# Altium project NA61_BPD_FEE.PrjPcb (part 2 of 4)

## Sheet Amp.SchDoc
size A4
Used 100 times, as channels U_Bank1/U_Amp, U_Bank1/U_Amp, U_Bank1/U_Amp, U_Bank1/U_Amp, U_Bank1/U_Amp, U_Bank2/U_Amp, U_Bank2/U_Amp, U_Bank2/U_Amp, U_Bank2/U_Amp, U_Bank2/U_Amp, U_Bank3/U_Amp, U_Bank3/U_Amp, U_Bank3/U_Amp, U_Bank3/U_Amp, U_Bank3/U_Amp, U_Bank4/U_Amp, U_Bank4/U_Amp, U_Bank4/U_Amp, U_Bank4/U_Amp, U_Bank4/U_Amp, U_Bank5/U_Amp, U_Bank5/U_Amp, U_Bank5/U_Amp, U_Bank5/U_Amp, U_Bank5/U_Amp, U_Bank6/U_Amp, U_Bank6/U_Amp, U_Bank6/U_Amp, U_Bank6/U_Amp, U_Bank6/U_Amp, U_Bank7/U_Amp, U_Bank7/U_Amp, U_Bank7/U_Amp, U_Bank7/U_Amp, U_Bank7/U_Amp, U_Bank8/U_Amp, U_Bank8/U_Amp, U_Bank8/U_Amp, U_Bank8/U_Amp, U_Bank8/U_Amp, U_Bank9/U_Amp, U_Bank9/U_Amp, U_Bank9/U_Amp, U_Bank9/U_Amp, U_Bank9/U_Amp, U_Bank10/U_Amp, U_Bank10/U_Amp, U_Bank10/U_Amp, U_Bank10/U_Amp, U_Bank10/U_Amp, U_Bank11/U_Amp, U_Bank11/U_Amp, U_Bank11/U_Amp, U_Bank11/U_Amp, U_Bank11/U_Amp, U_Bank12/U_Amp, U_Bank12/U_Amp, U_Bank12/U_Amp, U_Bank12/U_Amp, U_Bank12/U_Amp, U_Bank13/U_Amp, U_Bank13/U_Amp, U_Bank13/U_Amp, U_Bank13/U_Amp, U_Bank13/U_Amp, U_Bank14/U_Amp, U_Bank14/U_Amp, U_Bank14/U_Amp, U_Bank14/U_Amp, U_Bank14/U_Amp, U_Bank15/U_Amp, U_Bank15/U_Amp, U_Bank15/U_Amp, U_Bank15/U_Amp, U_Bank15/U_Amp, U_Bank16/U_Amp, U_Bank16/U_Amp, U_Bank16/U_Amp, U_Bank16/U_Amp, U_Bank16/U_Amp, U_Bank17/U_Amp, U_Bank17/U_Amp, U_Bank17/U_Amp, U_Bank17/U_Amp, U_Bank17/U_Amp, U_Bank18/U_Amp, U_Bank18/U_Amp, U_Bank18/U_Amp, U_Bank18/U_Amp, U_Bank18/U_Amp, U_Bank19/U_Amp, U_Bank19/U_Amp, U_Bank19/U_Amp, U_Bank19/U_Amp, U_Bank19/U_Amp, U_Bank20/U_Amp, U_Bank20/U_Amp, U_Bank20/U_Amp, U_Bank20/U_Amp, U_Bank20/U_Amp. Parts and nets are listed once, with the designators drawn on the sheet.
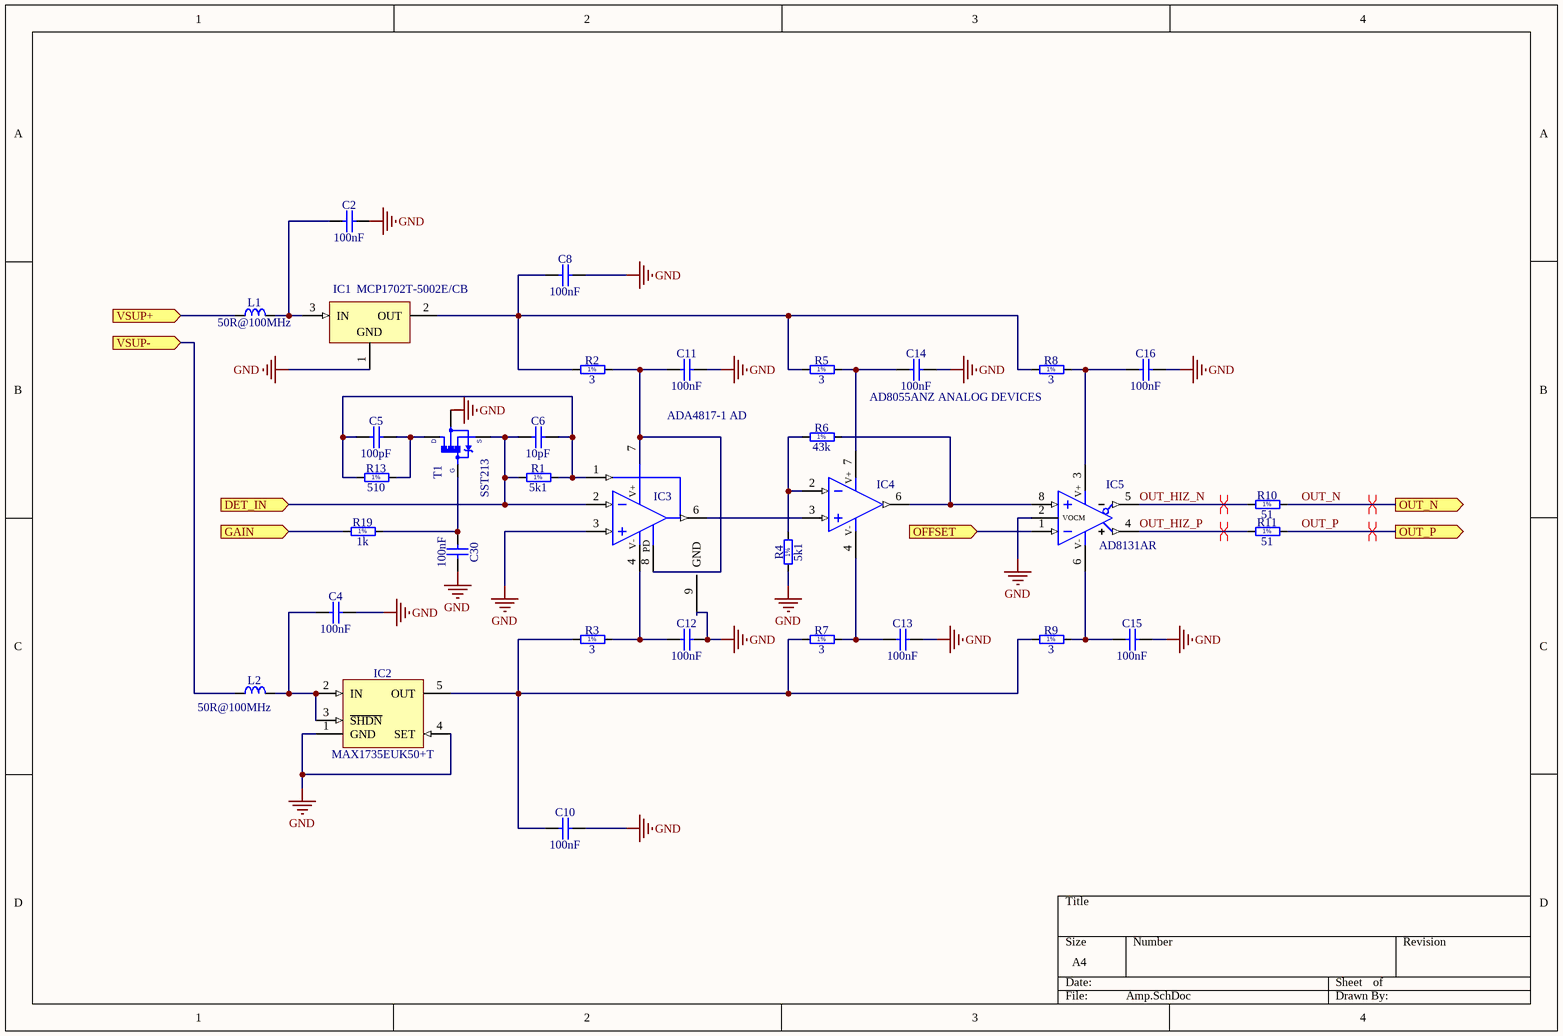
[diagram p2: Amp.SchDoc]

### Parts
C2  100nF  [CAPC2012X135N]
C4  100nF  [CAPC2012X135N]
C5  100pF  [CAPC2012X88N]
C6  10pF  [CAPC2012X135N]
C8  100nF  [CAPC2012X135N]
C10  100nF  [CAPC2012X135N]
C11  100nF  [CAPC2012X135N]
C12  100nF  [CAPC2012X135N]
C13  100nF  [CAPC2012X135N]
C14  100nF  [CAPC2012X135N]
C15  100nF  [CAPC2012X135N]
C16  100nF  [CAPC2012X135N]
C30  100nF  [CAPC2012X135N]
IC1  MCP1702T-5002E/CB  [SOT95P255X145-3N]
IC2  MAX1735EUK50+T  [SOT95P280X145-5N]
IC3  ADA4817-1 AD  [SOIC127P600X175-9N-S229]
IC4  AD8055ANZ ANALOG DEVICES  [SOIC127P600X175-8N]
IC5  AD8131AR  [SOIC127P600X175-8N]
L1  50R@100MHz  [IND_MURATA_BLM31PG]
L2  50R@100MHz  [IND_MURATA_BLM31PG]
R1  5k1  [RESC2012X60N]
R2  3  [RESC2012X60N]
R3  3  [RESC2012X60N]
R4  5k1  [RESC2012X60N]
R5  3  [RESC2012X60N]
R6  43k  [RESC2012X60N]
R7  3  [RESC2012X60N]
R8  3  [RESC2012X60N]
R9  3  [RESC2012X60N]
R10  51  [RESC2012X60N]
R11  51  [RESC2012X60N]
R13  510  [RESC2012X60N]
R19  1k  [RESC2012X60N]
T1  SST213  [SOT143N]

### Ports
DET_IN (in), GAIN (in), OFFSET (in), OUT_N (out), OUT_P (out), VSUP+ (in), VSUP- (in)

### Nets
GND: C2.2 C4.2 C8.2 C10.2 C11.2 C12.2 C13.2 C14.2 C15.2 C16.2 C30.2 IC1.1(GND) IC2.1(GND) IC2.4(SET) IC3.3(IN+) IC3.9(GND) IC5.2(VOCM) R4.1 T1.1(BODY)
DET_IN: C6.1 IC3.2(IN-) R1.1 T1.2(S) ; port DET_IN
GAIN: R19.1 ; port GAIN
OFFSET: IC5.1(IN-) ; port OFFSET
OUT_HIZ_N: IC5.5(VOUT-) R10.1
OUT_HIZ_P: IC5.4(VOUT+) R11.1
OUT_N: R10.2 ; port OUT_N
OUT_P: R11.2 ; port OUT_P
VSUP+: L1.1 ; port VSUP+
VSUP-: L2.1 ; port VSUP-
NetC2_1: C2.1 IC1.3(IN) L1.2
NetC4_1: C4.1 IC2.2(IN) IC2.3(~{SHDN}) L2.2
NetC5_1: C5.1 C6.2 IC3.1(FB) R1.2 R13.1
NetC5_2: C5.2 R13.2 T1.3(D)
NetC8_1: C8.1 IC1.2(OUT) R2.1 R5.1 R8.1
NetC10_1: C10.1 IC2.5(OUT) R3.1 R7.1 R9.1
NetC11_1: C11.1 IC3.7(V+) IC3.8(PD) R2.2
NetC12_1: C12.1 IC3.4(V-) R3.2
NetC13_1: C13.1 IC4.4(V-) R7.2
NetC14_1: C14.1 IC4.7(V+) R5.2
NetC15_1: C15.1 IC5.6(V-) R9.2
NetC16_1: C16.1 IC5.3(V+) R8.2
NetC30_1: C30.1 R19.2 T1.4(G)
NetIC3_6: IC3.6(OUT) IC4.3(IN+)
NetIC4_2: IC4.2(IN-) R4.2 R6.1
NetIC4_6: IC4.6(OUT) IC5.8(IN+) R6.2

### Channels
U_Bank1/U_Amp: designators C2=C2_U_Amp5 C4=C4_U_Amp5 C5=C5_U_Amp5 C6=C6_U_Amp5 C8=C8_U_Amp5 C10=C10_U_Amp5 C11=C11_U_Amp5 C12=C12_U_Amp5 C13=C13_U_Amp5 C14=C14_U_Amp5 C15=C15_U_Amp5 C16=C16_U_Amp5 C30=C30_U_Bank1_U_Amp#1 IC1=IC1_U_Amp5 IC2=IC2_U_Amp5 IC3=IC3_U_Amp5 IC4=IC4_U_Amp5 IC5=IC5_U_Amp5 L1=L1_U_Amp5 L2=L2_U_Amp5 R1=R1_U_Amp5 R2=R2_U_Amp5 R3=R3_U_Amp5 R4=R4_U_Amp5 R5=R5_U_Amp5 R6=R6_U_Amp5 R7=R7_U_Amp5 R8=R8_U_Amp5 R9=R9_U_Amp5 R10=R10_U_Amp5 R11=R11_U_Amp5 R13=R13_U_Amp5 R19=R19_U_Bank1_U_Amp#1 T1=T1_U_Amp5; ports DET_IN=DET_IN_A GAIN=NetP1_2 OFFSET=NetIC5_U_Amp1_1 OUT_N=OUT_A_N_U_Bank1 OUT_P=OUT_A_P_U_Bank1 VSUP+=+VSUP VSUP-=-VSUP
U_Bank1/U_Amp: designators C2=C2_U_Amp4 C4=C4_U_Amp4 C5=C5_U_Amp4 C6=C6_U_Amp4 C8=C8_U_Amp4 C10=C10_U_Amp4 C11=C11_U_Amp4 C12=C12_U_Amp4 C13=C13_U_Amp4 C14=C14_U_Amp4 C15=C15_U_Amp4 C16=C16_U_Amp4 C30=C30_U_Bank1_U_Amp#2 IC1=IC1_U_Amp4 IC2=IC2_U_Amp4 IC3=IC3_U_Amp4 IC4=IC4_U_Amp4 IC5=IC5_U_Amp4 L1=L1_U_Amp4 L2=L2_U_Amp4 R1=R1_U_Amp4 R2=R2_U_Amp4 R3=R3_U_Amp4 R4=R4_U_Amp4 R5=R5_U_Amp4 R6=R6_U_Amp4 R7=R7_U_Amp4 R8=R8_U_Amp4 R9=R9_U_Amp4 R10=R10_U_Amp4 R11=R11_U_Amp4 R13=R13_U_Amp4 R19=R19_U_Bank1_U_Amp#2 T1=T1_U_Amp4; ports DET_IN=DET_IN_B GAIN=NetP1_2 OFFSET=NetIC5_U_Amp1_1 OUT_N=OUT_B_N_U_Bank1 OUT_P=OUT_B_P_U_Bank1 VSUP+=+VSUP VSUP-=-VSUP
U_Bank1/U_Amp: designators C2=C2_U_Amp3 C4=C4_U_Amp3 C5=C5_U_Amp3 C6=C6_U_Amp3 C8=C8_U_Amp3 C10=C10_U_Amp3 C11=C11_U_Amp3 C12=C12_U_Amp3 C13=C13_U_Amp3 C14=C14_U_Amp3 C15=C15_U_Amp3 C16=C16_U_Amp3 C30=C30_U_Bank1_U_Amp#3 IC1=IC1_U_Amp3 IC2=IC2_U_Amp3 IC3=IC3_U_Amp3 IC4=IC4_U_Amp3 IC5=IC5_U_Amp3 L1=L1_U_Amp3 L2=L2_U_Amp3 R1=R1_U_Amp3 R2=R2_U_Amp3 R3=R3_U_Amp3 R4=R4_U_Amp3 R5=R5_U_Amp3 R6=R6_U_Amp3 R7=R7_U_Amp3 R8=R8_U_Amp3 R9=R9_U_Amp3 R10=R10_U_Amp3 R11=R11_U_Amp3 R13=R13_U_Amp3 R19=R19_U_Bank1_U_Amp#3 T1=T1_U_Amp3; ports DET_IN=DET_IN_C GAIN=NetP1_2 OFFSET=NetIC5_U_Amp1_1 OUT_N=OUT_C_N_U_Bank1 OUT_P=OUT_C_P_U_Bank1 VSUP+=+VSUP VSUP-=-VSUP
U_Bank1/U_Amp: designators C2=C2_U_Amp2 C4=C4_U_Amp2 C5=C5_U_Amp2 C6=C6_U_Amp2 C8=C8_U_Amp2 C10=C10_U_Amp2 C11=C11_U_Amp2 C12=C12_U_Amp2 C13=C13_U_Amp2 C14=C14_U_Amp2 C15=C15_U_Amp2 C16=C16_U_Amp2 C30=C30_U_Bank1_U_Amp#4 IC1=IC1_U_Amp2 IC2=IC2_U_Amp2 IC3=IC3_U_Amp2 IC4=IC4_U_Amp2 IC5=IC5_U_Amp2 L1=L1_U_Amp2 L2=L2_U_Amp2 R1=R1_U_Amp2 R2=R2_U_Amp2 R3=R3_U_Amp2 R4=R4_U_Amp2 R5=R5_U_Amp2 R6=R6_U_Amp2 R7=R7_U_Amp2 R8=R8_U_Amp2 R9=R9_U_Amp2 R10=R10_U_Amp2 R11=R11_U_Amp2 R13=R13_U_Amp2 R19=R19_U_Bank1_U_Amp#4 T1=T1_U_Amp2; ports DET_IN=DET_IN_D GAIN=NetP1_2 OFFSET=NetIC5_U_Amp1_1 OUT_N=OUT_D_N_U_Bank1 OUT_P=OUT_D_P_U_Bank1 VSUP+=+VSUP VSUP-=-VSUP
U_Bank1/U_Amp: designators C2=C2_U_Amp1 C4=C4_U_Amp1 C5=C5_U_Amp1 C6=C6_U_Amp1 C8=C8_U_Amp1 C10=C10_U_Amp1 C11=C11_U_Amp1 C12=C12_U_Amp1 C13=C13_U_Amp1 C14=C14_U_Amp1 C15=C15_U_Amp1 C16=C16_U_Amp1 C30=C30_U_Bank1_U_Amp#5 IC1=IC1_U_Amp1 IC2=IC2_U_Amp1 IC3=IC3_U_Amp1 IC4=IC4_U_Amp1 IC5=IC5_U_Amp1 L1=L1_U_Amp1 L2=L2_U_Amp1 R1=R1_U_Amp1 R2=R2_U_Amp1 R3=R3_U_Amp1 R4=R4_U_Amp1 R5=R5_U_Amp1 R6=R6_U_Amp1 R7=R7_U_Amp1 R8=R8_U_Amp1 R9=R9_U_Amp1 R10=R10_U_Amp1 R11=R11_U_Amp1 R13=R13_U_Amp1 R19=R19_U_Bank1_U_Amp#5 T1=T1_U_Amp1; ports DET_IN=DET_IN_E GAIN=NetP1_2 OFFSET=NetIC5_U_Amp1_1 OUT_N=OUT_E_N_U_Bank1 OUT_P=OUT_E_P_U_Bank1 VSUP+=+VSUP VSUP-=-VSUP
U_Bank2/U_Amp: designators end in _U_Bank2_U_Amp#1; ports DET_IN=DET_IN_A GAIN=NetP1_2 OFFSET=NetIC5_U_Bank2_U_Amp#1_1 OUT_N=OUT_A_N_U_Bank2 OUT_P=OUT_A_P_U_Bank2 VSUP+=+VSUP VSUP-=-VSUP
U_Bank2/U_Amp: designators end in _U_Bank2_U_Amp#2; ports DET_IN=DET_IN_B GAIN=NetP1_2 OFFSET=NetIC5_U_Bank2_U_Amp#1_1 OUT_N=OUT_B_N_U_Bank2 OUT_P=OUT_B_P_U_Bank2 VSUP+=+VSUP VSUP-=-VSUP
U_Bank2/U_Amp: designators end in _U_Bank2_U_Amp#3; ports DET_IN=DET_IN_C GAIN=NetP1_2 OFFSET=NetIC5_U_Bank2_U_Amp#1_1 OUT_N=OUT_C_N_U_Bank2 OUT_P=OUT_C_P_U_Bank2 VSUP+=+VSUP VSUP-=-VSUP
U_Bank2/U_Amp: designators end in _U_Bank2_U_Amp#4; ports DET_IN=DET_IN_D GAIN=NetP1_2 OFFSET=NetIC5_U_Bank2_U_Amp#1_1 OUT_N=OUT_D_N_U_Bank2 OUT_P=OUT_D_P_U_Bank2 VSUP+=+VSUP VSUP-=-VSUP
U_Bank2/U_Amp: designators end in _U_Bank2_U_Amp#5; ports DET_IN=DET_IN_E GAIN=NetP1_2 OFFSET=NetIC5_U_Bank2_U_Amp#1_1 OUT_N=OUT_E_N_U_Bank2 OUT_P=OUT_E_P_U_Bank2 VSUP+=+VSUP VSUP-=-VSUP
U_Bank3/U_Amp: designators end in _U_Bank3_U_Amp#1; ports DET_IN=DET_IN_A GAIN=NetP1_2 OFFSET=NetIC5_U_Bank3_U_Amp#1_1 OUT_N=OUT_A_N_U_Bank3 OUT_P=OUT_A_P_U_Bank3 VSUP+=+VSUP VSUP-=-VSUP
U_Bank3/U_Amp: designators end in _U_Bank3_U_Amp#2; ports DET_IN=DET_IN_B GAIN=NetP1_2 OFFSET=NetIC5_U_Bank3_U_Amp#1_1 OUT_N=OUT_B_N_U_Bank3 OUT_P=OUT_B_P_U_Bank3 VSUP+=+VSUP VSUP-=-VSUP
U_Bank3/U_Amp: designators end in _U_Bank3_U_Amp#3; ports DET_IN=DET_IN_C GAIN=NetP1_2 OFFSET=NetIC5_U_Bank3_U_Amp#1_1 OUT_N=OUT_C_N_U_Bank3 OUT_P=OUT_C_P_U_Bank3 VSUP+=+VSUP VSUP-=-VSUP
U_Bank3/U_Amp: designators end in _U_Bank3_U_Amp#4; ports DET_IN=DET_IN_D GAIN=NetP1_2 OFFSET=NetIC5_U_Bank3_U_Amp#1_1 OUT_N=OUT_D_N_U_Bank3 OUT_P=OUT_D_P_U_Bank3 VSUP+=+VSUP VSUP-=-VSUP
U_Bank3/U_Amp: designators end in _U_Bank3_U_Amp#5; ports DET_IN=DET_IN_E GAIN=NetP1_2 OFFSET=NetIC5_U_Bank3_U_Amp#1_1 OUT_N=OUT_E_N_U_Bank3 OUT_P=OUT_E_P_U_Bank3 VSUP+=+VSUP VSUP-=-VSUP
U_Bank4/U_Amp: designators end in _U_Bank4_U_Amp#1; ports DET_IN=DET_IN_A GAIN=NetP1_2 OFFSET=NetIC5_U_Bank4_U_Amp#1_1 OUT_N=OUT_A_N_U_Bank4 OUT_P=OUT_A_P_U_Bank4 VSUP+=+VSUP VSUP-=-VSUP
U_Bank4/U_Amp: designators end in _U_Bank4_U_Amp#2; ports DET_IN=DET_IN_B GAIN=NetP1_2 OFFSET=NetIC5_U_Bank4_U_Amp#1_1 OUT_N=OUT_B_N_U_Bank4 OUT_P=OUT_B_P_U_Bank4 VSUP+=+VSUP VSUP-=-VSUP
U_Bank4/U_Amp: designators end in _U_Bank4_U_Amp#3; ports DET_IN=DET_IN_C GAIN=NetP1_2 OFFSET=NetIC5_U_Bank4_U_Amp#1_1 OUT_N=OUT_C_N_U_Bank4 OUT_P=OUT_C_P_U_Bank4 VSUP+=+VSUP VSUP-=-VSUP
U_Bank4/U_Amp: designators end in _U_Bank4_U_Amp#4; ports DET_IN=DET_IN_D GAIN=NetP1_2 OFFSET=NetIC5_U_Bank4_U_Amp#1_1 OUT_N=OUT_D_N_U_Bank4 OUT_P=OUT_D_P_U_Bank4 VSUP+=+VSUP VSUP-=-VSUP
U_Bank4/U_Amp: designators end in _U_Bank4_U_Amp#5; ports DET_IN=DET_IN_E GAIN=NetP1_2 OFFSET=NetIC5_U_Bank4_U_Amp#1_1 OUT_N=OUT_E_N_U_Bank4 OUT_P=OUT_E_P_U_Bank4 VSUP+=+VSUP VSUP-=-VSUP
U_Bank5/U_Amp: designators end in _U_Bank5_U_Amp#1; ports DET_IN=DET_IN_A GAIN=NetP1_2 OFFSET=NetIC5_U_Bank5_U_Amp#1_1 OUT_N=OUT_A_N_U_Bank5 OUT_P=OUT_A_P_U_Bank5 VSUP+=+VSUP VSUP-=-VSUP
U_Bank5/U_Amp: designators end in _U_Bank5_U_Amp#2; ports DET_IN=DET_IN_B GAIN=NetP1_2 OFFSET=NetIC5_U_Bank5_U_Amp#1_1 OUT_N=OUT_B_N_U_Bank5 OUT_P=OUT_B_P_U_Bank5 VSUP+=+VSUP VSUP-=-VSUP
U_Bank5/U_Amp: designators end in _U_Bank5_U_Amp#3; ports DET_IN=DET_IN_C GAIN=NetP1_2 OFFSET=NetIC5_U_Bank5_U_Amp#1_1 OUT_N=OUT_C_N_U_Bank5 OUT_P=OUT_C_P_U_Bank5 VSUP+=+VSUP VSUP-=-VSUP
U_Bank5/U_Amp: designators end in _U_Bank5_U_Amp#4; ports DET_IN=DET_IN_D GAIN=NetP1_2 OFFSET=NetIC5_U_Bank5_U_Amp#1_1 OUT_N=OUT_D_N_U_Bank5 OUT_P=OUT_D_P_U_Bank5 VSUP+=+VSUP VSUP-=-VSUP
U_Bank5/U_Amp: designators end in _U_Bank5_U_Amp#5; ports DET_IN=DET_IN_E GAIN=NetP1_2 OFFSET=NetIC5_U_Bank5_U_Amp#1_1 OUT_N=OUT_E_N_U_Bank5 OUT_P=OUT_E_P_U_Bank5 VSUP+=+VSUP VSUP-=-VSUP
U_Bank6/U_Amp: designators end in _U_Bank6_U_Amp#1; ports DET_IN=DET_IN_A GAIN=NetP1_2 OFFSET=NetIC5_U_Bank6_U_Amp#1_1 OUT_N=OUT_A_N_U_Bank6 OUT_P=OUT_A_P_U_Bank6 VSUP+=+VSUP VSUP-=-VSUP
U_Bank6/U_Amp: designators end in _U_Bank6_U_Amp#2; ports DET_IN=DET_IN_B GAIN=NetP1_2 OFFSET=NetIC5_U_Bank6_U_Amp#1_1 OUT_N=OUT_B_N_U_Bank6 OUT_P=OUT_B_P_U_Bank6 VSUP+=+VSUP VSUP-=-VSUP
U_Bank6/U_Amp: designators end in _U_Bank6_U_Amp#3; ports DET_IN=DET_IN_C GAIN=NetP1_2 OFFSET=NetIC5_U_Bank6_U_Amp#1_1 OUT_N=OUT_C_N_U_Bank6 OUT_P=OUT_C_P_U_Bank6 VSUP+=+VSUP VSUP-=-VSUP
U_Bank6/U_Amp: designators end in _U_Bank6_U_Amp#4; ports DET_IN=DET_IN_D GAIN=NetP1_2 OFFSET=NetIC5_U_Bank6_U_Amp#1_1 OUT_N=OUT_D_N_U_Bank6 OUT_P=OUT_D_P_U_Bank6 VSUP+=+VSUP VSUP-=-VSUP
U_Bank6/U_Amp: designators end in _U_Bank6_U_Amp#5; ports DET_IN=DET_IN_E GAIN=NetP1_2 OFFSET=NetIC5_U_Bank6_U_Amp#1_1 OUT_N=OUT_E_N_U_Bank6 OUT_P=OUT_E_P_U_Bank6 VSUP+=+VSUP VSUP-=-VSUP
U_Bank7/U_Amp: designators end in _U_Bank7_U_Amp#1; ports DET_IN=DET_IN_A GAIN=NetP1_2 OFFSET=NetIC5_U_Bank7_U_Amp#1_1 OUT_N=OUT_A_N_U_Bank7 OUT_P=OUT_A_P_U_Bank7 VSUP+=+VSUP VSUP-=-VSUP
U_Bank7/U_Amp: designators end in _U_Bank7_U_Amp#2; ports DET_IN=DET_IN_B GAIN=NetP1_2 OFFSET=NetIC5_U_Bank7_U_Amp#1_1 OUT_N=OUT_B_N_U_Bank7 OUT_P=OUT_B_P_U_Bank7 VSUP+=+VSUP VSUP-=-VSUP
U_Bank7/U_Amp: designators end in _U_Bank7_U_Amp#3; ports DET_IN=DET_IN_C GAIN=NetP1_2 OFFSET=NetIC5_U_Bank7_U_Amp#1_1 OUT_N=OUT_C_N_U_Bank7 OUT_P=OUT_C_P_U_Bank7 VSUP+=+VSUP VSUP-=-VSUP
U_Bank7/U_Amp: designators end in _U_Bank7_U_Amp#4; ports DET_IN=DET_IN_D GAIN=NetP1_2 OFFSET=NetIC5_U_Bank7_U_Amp#1_1 OUT_N=OUT_D_N_U_Bank7 OUT_P=OUT_D_P_U_Bank7 VSUP+=+VSUP VSUP-=-VSUP
U_Bank7/U_Amp: designators end in _U_Bank7_U_Amp#5; ports DET_IN=DET_IN_E GAIN=NetP1_2 OFFSET=NetIC5_U_Bank7_U_Amp#1_1 OUT_N=OUT_E_N_U_Bank7 OUT_P=OUT_E_P_U_Bank7 VSUP+=+VSUP VSUP-=-VSUP
U_Bank8/U_Amp: designators end in _U_Bank8_U_Amp#1; ports DET_IN=DET_IN_A GAIN=NetP1_2 OFFSET=NetIC5_U_Bank8_U_Amp#1_1 OUT_N=OUT_A_N_U_Bank8 OUT_P=OUT_A_P_U_Bank8 VSUP+=+VSUP VSUP-=-VSUP
U_Bank8/U_Amp: designators end in _U_Bank8_U_Amp#2; ports DET_IN=DET_IN_B GAIN=NetP1_2 OFFSET=NetIC5_U_Bank8_U_Amp#1_1 OUT_N=OUT_B_N_U_Bank8 OUT_P=OUT_B_P_U_Bank8 VSUP+=+VSUP VSUP-=-VSUP
U_Bank8/U_Amp: designators end in _U_Bank8_U_Amp#3; ports DET_IN=DET_IN_C GAIN=NetP1_2 OFFSET=NetIC5_U_Bank8_U_Amp#1_1 OUT_N=OUT_C_N_U_Bank8 OUT_P=OUT_C_P_U_Bank8 VSUP+=+VSUP VSUP-=-VSUP
U_Bank8/U_Amp: designators end in _U_Bank8_U_Amp#4; ports DET_IN=DET_IN_D GAIN=NetP1_2 OFFSET=NetIC5_U_Bank8_U_Amp#1_1 OUT_N=OUT_D_N_U_Bank8 OUT_P=OUT_D_P_U_Bank8 VSUP+=+VSUP VSUP-=-VSUP
U_Bank8/U_Amp: designators end in _U_Bank8_U_Amp#5; ports DET_IN=DET_IN_E GAIN=NetP1_2 OFFSET=NetIC5_U_Bank8_U_Amp#1_1 OUT_N=OUT_E_N_U_Bank8 OUT_P=OUT_E_P_U_Bank8 VSUP+=+VSUP VSUP-=-VSUP
U_Bank9/U_Amp: designators end in _U_Bank9_U_Amp#1; ports DET_IN=DET_IN_A GAIN=NetP1_2 OFFSET=NetIC5_U_Bank9_U_Amp#1_1 OUT_N=OUT_A_N_U_Bank9 OUT_P=OUT_A_P_U_Bank9 VSUP+=+VSUP VSUP-=-VSUP
U_Bank9/U_Amp: designators end in _U_Bank9_U_Amp#2; ports DET_IN=DET_IN_B GAIN=NetP1_2 OFFSET=NetIC5_U_Bank9_U_Amp#1_1 OUT_N=OUT_B_N_U_Bank9 OUT_P=OUT_B_P_U_Bank9 VSUP+=+VSUP VSUP-=-VSUP
U_Bank9/U_Amp: designators end in _U_Bank9_U_Amp#3; ports DET_IN=DET_IN_C GAIN=NetP1_2 OFFSET=NetIC5_U_Bank9_U_Amp#1_1 OUT_N=OUT_C_N_U_Bank9 OUT_P=OUT_C_P_U_Bank9 VSUP+=+VSUP VSUP-=-VSUP
U_Bank9/U_Amp: designators end in _U_Bank9_U_Amp#4; ports DET_IN=DET_IN_D GAIN=NetP1_2 OFFSET=NetIC5_U_Bank9_U_Amp#1_1 OUT_N=OUT_D_N_U_Bank9 OUT_P=OUT_D_P_U_Bank9 VSUP+=+VSUP VSUP-=-VSUP
U_Bank9/U_Amp: designators end in _U_Bank9_U_Amp#5; ports DET_IN=DET_IN_E GAIN=NetP1_2 OFFSET=NetIC5_U_Bank9_U_Amp#1_1 OUT_N=OUT_E_N_U_Bank9 OUT_P=OUT_E_P_U_Bank9 VSUP+=+VSUP VSUP-=-VSUP
U_Bank10/U_Amp: designators end in _U_Bank10_U_Amp#1; ports DET_IN=DET_IN_A GAIN=NetP1_2 OFFSET=NetIC5_U_Bank10_U_Amp#1_1 OUT_N=OUT_A_N_U_Bank10 OUT_P=OUT_A_P_U_Bank10 VSUP+=+VSUP VSUP-=-VSUP
U_Bank10/U_Amp: designators end in _U_Bank10_U_Amp#2; ports DET_IN=DET_IN_B GAIN=NetP1_2 OFFSET=NetIC5_U_Bank10_U_Amp#1_1 OUT_N=OUT_B_N_U_Bank10 OUT_P=OUT_B_P_U_Bank10 VSUP+=+VSUP VSUP-=-VSUP
U_Bank10/U_Amp: designators end in _U_Bank10_U_Amp#3; ports DET_IN=DET_IN_C GAIN=NetP1_2 OFFSET=NetIC5_U_Bank10_U_Amp#1_1 OUT_N=OUT_C_N_U_Bank10 OUT_P=OUT_C_P_U_Bank10 VSUP+=+VSUP VSUP-=-VSUP
U_Bank10/U_Amp: designators end in _U_Bank10_U_Amp#4; ports DET_IN=DET_IN_D GAIN=NetP1_2 OFFSET=NetIC5_U_Bank10_U_Amp#1_1 OUT_N=OUT_D_N_U_Bank10 OUT_P=OUT_D_P_U_Bank10 VSUP+=+VSUP VSUP-=-VSUP
U_Bank10/U_Amp: designators end in _U_Bank10_U_Amp#5; ports DET_IN=DET_IN_E GAIN=NetP1_2 OFFSET=NetIC5_U_Bank10_U_Amp#1_1 OUT_N=OUT_E_N_U_Bank10 OUT_P=OUT_E_P_U_Bank10 VSUP+=+VSUP VSUP-=-VSUP
U_Bank11/U_Amp: designators end in _U_Bank11_U_Amp#1; ports DET_IN=DET_IN_A GAIN=NetP1_2 OFFSET=NetIC5_U_Bank11_U_Amp#1_1 OUT_N=OUT_A_N_U_Bank11 OUT_P=OUT_A_P_U_Bank11 VSUP+=+VSUP VSUP-=-VSUP
U_Bank11/U_Amp: designators end in _U_Bank11_U_Amp#2; ports DET_IN=DET_IN_B GAIN=NetP1_2 OFFSET=NetIC5_U_Bank11_U_Amp#1_1 OUT_N=OUT_B_N_U_Bank11 OUT_P=OUT_B_P_U_Bank11 VSUP+=+VSUP VSUP-=-VSUP
U_Bank11/U_Amp: designators end in _U_Bank11_U_Amp#3; ports DET_IN=DET_IN_C GAIN=NetP1_2 OFFSET=NetIC5_U_Bank11_U_Amp#1_1 OUT_N=OUT_C_N_U_Bank11 OUT_P=OUT_C_P_U_Bank11 VSUP+=+VSUP VSUP-=-VSUP
U_Bank11/U_Amp: designators end in _U_Bank11_U_Amp#4; ports DET_IN=DET_IN_D GAIN=NetP1_2 OFFSET=NetIC5_U_Bank11_U_Amp#1_1 OUT_N=OUT_D_N_U_Bank11 OUT_P=OUT_D_P_U_Bank11 VSUP+=+VSUP VSUP-=-VSUP
U_Bank11/U_Amp: designators end in _U_Bank11_U_Amp#5; ports DET_IN=DET_IN_E GAIN=NetP1_2 OFFSET=NetIC5_U_Bank11_U_Amp#1_1 OUT_N=OUT_E_N_U_Bank11 OUT_P=OUT_E_P_U_Bank11 VSUP+=+VSUP VSUP-=-VSUP
U_Bank12/U_Amp: designators end in _U_Bank12_U_Amp#1; ports DET_IN=DET_IN_A GAIN=NetP1_2 OFFSET=NetIC5_U_Bank12_U_Amp#1_1 OUT_N=OUT_A_N_U_Bank12 OUT_P=OUT_A_P_U_Bank12 VSUP+=+VSUP VSUP-=-VSUP
U_Bank12/U_Amp: designators end in _U_Bank12_U_Amp#2; ports DET_IN=DET_IN_B GAIN=NetP1_2 OFFSET=NetIC5_U_Bank12_U_Amp#1_1 OUT_N=OUT_B_N_U_Bank12 OUT_P=OUT_B_P_U_Bank12 VSUP+=+VSUP VSUP-=-VSUP
U_Bank12/U_Amp: designators end in _U_Bank12_U_Amp#3; ports DET_IN=DET_IN_C GAIN=NetP1_2 OFFSET=NetIC5_U_Bank12_U_Amp#1_1 OUT_N=OUT_C_N_U_Bank12 OUT_P=OUT_C_P_U_Bank12 VSUP+=+VSUP VSUP-=-VSUP
U_Bank12/U_Amp: designators end in _U_Bank12_U_Amp#4; ports DET_IN=DET_IN_D GAIN=NetP1_2 OFFSET=NetIC5_U_Bank12_U_Amp#1_1 OUT_N=OUT_D_N_U_Bank12 OUT_P=OUT_D_P_U_Bank12 VSUP+=+VSUP VSUP-=-VSUP
U_Bank12/U_Amp: designators end in _U_Bank12_U_Amp#5; ports DET_IN=DET_IN_E GAIN=NetP1_2 OFFSET=NetIC5_U_Bank12_U_Amp#1_1 OUT_N=OUT_E_N_U_Bank12 OUT_P=OUT_E_P_U_Bank12 VSUP+=+VSUP VSUP-=-VSUP
U_Bank13/U_Amp: designators end in _U_Bank13_U_Amp#1; ports DET_IN=DET_IN_A GAIN=NetP1_2 OFFSET=NetIC5_U_Bank13_U_Amp#1_1 OUT_N=OUT_A_N_U_Bank13 OUT_P=OUT_A_P_U_Bank13 VSUP+=+VSUP VSUP-=-VSUP
U_Bank13/U_Amp: designators end in _U_Bank13_U_Amp#2; ports DET_IN=DET_IN_B GAIN=NetP1_2 OFFSET=NetIC5_U_Bank13_U_Amp#1_1 OUT_N=OUT_B_N_U_Bank13 OUT_P=OUT_B_P_U_Bank13 VSUP+=+VSUP VSUP-=-VSUP
U_Bank13/U_Amp: designators end in _U_Bank13_U_Amp#3; ports DET_IN=DET_IN_C GAIN=NetP1_2 OFFSET=NetIC5_U_Bank13_U_Amp#1_1 OUT_N=OUT_C_N_U_Bank13 OUT_P=OUT_C_P_U_Bank13 VSUP+=+VSUP VSUP-=-VSUP
U_Bank13/U_Amp: designators end in _U_Bank13_U_Amp#4; ports DET_IN=DET_IN_D GAIN=NetP1_2 OFFSET=NetIC5_U_Bank13_U_Amp#1_1 OUT_N=OUT_D_N_U_Bank13 OUT_P=OUT_D_P_U_Bank13 VSUP+=+VSUP VSUP-=-VSUP
U_Bank13/U_Amp: designators end in _U_Bank13_U_Amp#5; ports DET_IN=DET_IN_E GAIN=NetP1_2 OFFSET=NetIC5_U_Bank13_U_Amp#1_1 OUT_N=OUT_E_N_U_Bank13 OUT_P=OUT_E_P_U_Bank13 VSUP+=+VSUP VSUP-=-VSUP
U_Bank14/U_Amp: designators end in _U_Bank14_U_Amp#1; ports DET_IN=DET_IN_A GAIN=NetP1_2 OFFSET=NetIC5_U_Bank14_U_Amp#1_1 OUT_N=OUT_A_N_U_Bank14 OUT_P=OUT_A_P_U_Bank14 VSUP+=+VSUP VSUP-=-VSUP
U_Bank14/U_Amp: designators end in _U_Bank14_U_Amp#2; ports DET_IN=DET_IN_B GAIN=NetP1_2 OFFSET=NetIC5_U_Bank14_U_Amp#1_1 OUT_N=OUT_B_N_U_Bank14 OUT_P=OUT_B_P_U_Bank14 VSUP+=+VSUP VSUP-=-VSUP
U_Bank14/U_Amp: designators end in _U_Bank14_U_Amp#3; ports DET_IN=DET_IN_C GAIN=NetP1_2 OFFSET=NetIC5_U_Bank14_U_Amp#1_1 OUT_N=OUT_C_N_U_Bank14 OUT_P=OUT_C_P_U_Bank14 VSUP+=+VSUP VSUP-=-VSUP
U_Bank14/U_Amp: designators end in _U_Bank14_U_Amp#4; ports DET_IN=DET_IN_D GAIN=NetP1_2 OFFSET=NetIC5_U_Bank14_U_Amp#1_1 OUT_N=OUT_D_N_U_Bank14 OUT_P=OUT_D_P_U_Bank14 VSUP+=+VSUP VSUP-=-VSUP
U_Bank14/U_Amp: designators end in _U_Bank14_U_Amp#5; ports DET_IN=DET_IN_E GAIN=NetP1_2 OFFSET=NetIC5_U_Bank14_U_Amp#1_1 OUT_N=OUT_E_N_U_Bank14 OUT_P=OUT_E_P_U_Bank14 VSUP+=+VSUP VSUP-=-VSUP
U_Bank15/U_Amp: designators end in _U_Bank15_U_Amp#1; ports DET_IN=DET_IN_A GAIN=NetP1_2 OFFSET=NetIC5_U_Bank15_U_Amp#1_1 OUT_N=OUT_A_N_U_Bank15 OUT_P=OUT_A_P_U_Bank15 VSUP+=+VSUP VSUP-=-VSUP
U_Bank15/U_Amp: designators end in _U_Bank15_U_Amp#2; ports DET_IN=DET_IN_B GAIN=NetP1_2 OFFSET=NetIC5_U_Bank15_U_Amp#1_1 OUT_N=OUT_B_N_U_Bank15 OUT_P=OUT_B_P_U_Bank15 VSUP+=+VSUP VSUP-=-VSUP
U_Bank15/U_Amp: designators end in _U_Bank15_U_Amp#3; ports DET_IN=DET_IN_C GAIN=NetP1_2 OFFSET=NetIC5_U_Bank15_U_Amp#1_1 OUT_N=OUT_C_N_U_Bank15 OUT_P=OUT_C_P_U_Bank15 VSUP+=+VSUP VSUP-=-VSUP
U_Bank15/U_Amp: designators end in _U_Bank15_U_Amp#4; ports DET_IN=DET_IN_D GAIN=NetP1_2 OFFSET=NetIC5_U_Bank15_U_Amp#1_1 OUT_N=OUT_D_N_U_Bank15 OUT_P=OUT_D_P_U_Bank15 VSUP+=+VSUP VSUP-=-VSUP
U_Bank15/U_Amp: designators end in _U_Bank15_U_Amp#5; ports DET_IN=DET_IN_E GAIN=NetP1_2 OFFSET=NetIC5_U_Bank15_U_Amp#1_1 OUT_N=OUT_E_N_U_Bank15 OUT_P=OUT_E_P_U_Bank15 VSUP+=+VSUP VSUP-=-VSUP
U_Bank16/U_Amp: designators end in _U_Bank16_U_Amp#1; ports DET_IN=DET_IN_A GAIN=NetP1_2 OFFSET=NetIC5_U_Bank16_U_Amp#1_1 OUT_N=OUT_A_N_U_Bank16 OUT_P=OUT_A_P_U_Bank16 VSUP+=+VSUP VSUP-=-VSUP
U_Bank16/U_Amp: designators end in _U_Bank16_U_Amp#2; ports DET_IN=DET_IN_B GAIN=NetP1_2 OFFSET=NetIC5_U_Bank16_U_Amp#1_1 OUT_N=OUT_B_N_U_Bank16 OUT_P=OUT_B_P_U_Bank16 VSUP+=+VSUP VSUP-=-VSUP
U_Bank16/U_Amp: designators end in _U_Bank16_U_Amp#3; ports DET_IN=DET_IN_C GAIN=NetP1_2 OFFSET=NetIC5_U_Bank16_U_Amp#1_1 OUT_N=OUT_C_N_U_Bank16 OUT_P=OUT_C_P_U_Bank16 VSUP+=+VSUP VSUP-=-VSUP
U_Bank16/U_Amp: designators end in _U_Bank16_U_Amp#4; ports DET_IN=DET_IN_D GAIN=NetP1_2 OFFSET=NetIC5_U_Bank16_U_Amp#1_1 OUT_N=OUT_D_N_U_Bank16 OUT_P=OUT_D_P_U_Bank16 VSUP+=+VSUP VSUP-=-VSUP
U_Bank16/U_Amp: designators end in _U_Bank16_U_Amp#5; ports DET_IN=DET_IN_E GAIN=NetP1_2 OFFSET=NetIC5_U_Bank16_U_Amp#1_1 OUT_N=OUT_E_N_U_Bank16 OUT_P=OUT_E_P_U_Bank16 VSUP+=+VSUP VSUP-=-VSUP
U_Bank17/U_Amp: designators end in _U_Bank17_U_Amp#1; ports DET_IN=DET_IN_A GAIN=NetP1_2 OFFSET=NetIC5_U_Bank17_U_Amp#1_1 OUT_N=OUT_A_N_U_Bank17 OUT_P=OUT_A_P_U_Bank17 VSUP+=+VSUP VSUP-=-VSUP
U_Bank17/U_Amp: designators end in _U_Bank17_U_Amp#2; ports DET_IN=DET_IN_B GAIN=NetP1_2 OFFSET=NetIC5_U_Bank17_U_Amp#1_1 OUT_N=OUT_B_N_U_Bank17 OUT_P=OUT_B_P_U_Bank17 VSUP+=+VSUP VSUP-=-VSUP
U_Bank17/U_Amp: designators end in _U_Bank17_U_Amp#3; ports DET_IN=DET_IN_C GAIN=NetP1_2 OFFSET=NetIC5_U_Bank17_U_Amp#1_1 OUT_N=OUT_C_N_U_Bank17 OUT_P=OUT_C_P_U_Bank17 VSUP+=+VSUP VSUP-=-VSUP
U_Bank17/U_Amp: designators end in _U_Bank17_U_Amp#4; ports DET_IN=DET_IN_D GAIN=NetP1_2 OFFSET=NetIC5_U_Bank17_U_Amp#1_1 OUT_N=OUT_D_N_U_Bank17 OUT_P=OUT_D_P_U_Bank17 VSUP+=+VSUP VSUP-=-VSUP
U_Bank17/U_Amp: designators end in _U_Bank17_U_Amp#5; ports DET_IN=DET_IN_E GAIN=NetP1_2 OFFSET=NetIC5_U_Bank17_U_Amp#1_1 OUT_N=OUT_E_N_U_Bank17 OUT_P=OUT_E_P_U_Bank17 VSUP+=+VSUP VSUP-=-VSUP
U_Bank18/U_Amp: designators end in _U_Bank18_U_Amp#1; ports DET_IN=DET_IN_A GAIN=NetP1_2 OFFSET=NetIC5_U_Bank18_U_Amp#1_1 OUT_N=OUT_A_N_U_Bank18 OUT_P=OUT_A_P_U_Bank18 VSUP+=+VSUP VSUP-=-VSUP
U_Bank18/U_Amp: designators end in _U_Bank18_U_Amp#2; ports DET_IN=DET_IN_B GAIN=NetP1_2 OFFSET=NetIC5_U_Bank18_U_Amp#1_1 OUT_N=OUT_B_N_U_Bank18 OUT_P=OUT_B_P_U_Bank18 VSUP+=+VSUP VSUP-=-VSUP
U_Bank18/U_Amp: designators end in _U_Bank18_U_Amp#3; ports DET_IN=DET_IN_C GAIN=NetP1_2 OFFSET=NetIC5_U_Bank18_U_Amp#1_1 OUT_N=OUT_C_N_U_Bank18 OUT_P=OUT_C_P_U_Bank18 VSUP+=+VSUP VSUP-=-VSUP
U_Bank18/U_Amp: designators end in _U_Bank18_U_Amp#4; ports DET_IN=DET_IN_D GAIN=NetP1_2 OFFSET=NetIC5_U_Bank18_U_Amp#1_1 OUT_N=OUT_D_N_U_Bank18 OUT_P=OUT_D_P_U_Bank18 VSUP+=+VSUP VSUP-=-VSUP
U_Bank18/U_Amp: designators end in _U_Bank18_U_Amp#5; ports DET_IN=DET_IN_E GAIN=NetP1_2 OFFSET=NetIC5_U_Bank18_U_Amp#1_1 OUT_N=OUT_E_N_U_Bank18 OUT_P=OUT_E_P_U_Bank18 VSUP+=+VSUP VSUP-=-VSUP
U_Bank19/U_Amp: designators end in _U_Bank19_U_Amp#1; ports DET_IN=DET_IN_A GAIN=NetP1_2 OFFSET=NetIC5_U_Bank19_U_Amp#1_1 OUT_N=OUT_A_N_U_Bank19 OUT_P=OUT_A_P_U_Bank19 VSUP+=+VSUP VSUP-=-VSUP
U_Bank19/U_Amp: designators end in _U_Bank19_U_Amp#2; ports DET_IN=DET_IN_B GAIN=NetP1_2 OFFSET=NetIC5_U_Bank19_U_Amp#1_1 OUT_N=OUT_B_N_U_Bank19 OUT_P=OUT_B_P_U_Bank19 VSUP+=+VSUP VSUP-=-VSUP
U_Bank19/U_Amp: designators end in _U_Bank19_U_Amp#3; ports DET_IN=DET_IN_C GAIN=NetP1_2 OFFSET=NetIC5_U_Bank19_U_Amp#1_1 OUT_N=OUT_C_N_U_Bank19 OUT_P=OUT_C_P_U_Bank19 VSUP+=+VSUP VSUP-=-VSUP
U_Bank19/U_Amp: designators end in _U_Bank19_U_Amp#4; ports DET_IN=DET_IN_D GAIN=NetP1_2 OFFSET=NetIC5_U_Bank19_U_Amp#1_1 OUT_N=OUT_D_N_U_Bank19 OUT_P=OUT_D_P_U_Bank19 VSUP+=+VSUP VSUP-=-VSUP
U_Bank19/U_Amp: designators end in _U_Bank19_U_Amp#5; ports DET_IN=DET_IN_E GAIN=NetP1_2 OFFSET=NetIC5_U_Bank19_U_Amp#1_1 OUT_N=OUT_E_N_U_Bank19 OUT_P=OUT_E_P_U_Bank19 VSUP+=+VSUP VSUP-=-VSUP
U_Bank20/U_Amp: designators end in _U_Bank20_U_Amp#1; ports DET_IN=DET_IN_A GAIN=NetP1_2 OFFSET=NetIC5_U_Bank20_U_Amp#1_1 OUT_N=OUT_A_N_U_Bank20 OUT_P=OUT_A_P_U_Bank20 VSUP+=+VSUP VSUP-=-VSUP
U_Bank20/U_Amp: designators end in _U_Bank20_U_Amp#2; ports DET_IN=DET_IN_B GAIN=NetP1_2 OFFSET=NetIC5_U_Bank20_U_Amp#1_1 OUT_N=OUT_B_N_U_Bank20 OUT_P=OUT_B_P_U_Bank20 VSUP+=+VSUP VSUP-=-VSUP
U_Bank20/U_Amp: designators end in _U_Bank20_U_Amp#3; ports DET_IN=DET_IN_C GAIN=NetP1_2 OFFSET=NetIC5_U_Bank20_U_Amp#1_1 OUT_N=OUT_C_N_U_Bank20 OUT_P=OUT_C_P_U_Bank20 VSUP+=+VSUP VSUP-=-VSUP
U_Bank20/U_Amp: designators end in _U_Bank20_U_Amp#4; ports DET_IN=DET_IN_D GAIN=NetP1_2 OFFSET=NetIC5_U_Bank20_U_Amp#1_1 OUT_N=OUT_D_N_U_Bank20 OUT_P=OUT_D_P_U_Bank20 VSUP+=+VSUP VSUP-=-VSUP
U_Bank20/U_Amp: designators end in _U_Bank20_U_Amp#5; ports DET_IN=DET_IN_E GAIN=NetP1_2 OFFSET=NetIC5_U_Bank20_U_Amp#1_1 OUT_N=OUT_E_N_U_Bank20 OUT_P=OUT_E_P_U_Bank20 VSUP+=+VSUP VSUP-=-VSUP

### Layout directives
differential pair: OUT_A_N_U_Bank1, OUT_A_P_U_Bank1, OUT_HIZ_N_U_Amp, OUT_HIZ_P_U_Amp

### Notes on the sheet
- (in symbol R0805_1K_1%_0.125W_100PPM) 1%
- (in symbol R0805_3R_1%_0.125W_200PPM) 1%
- (in symbol R0805_5K1_1%_0.125W_100PPM) 1%
- (in symbol R0805_43K_1%_0.125W_100PPM) 1%
- (in symbol R0805_51R_1%_0.125W_100PPM) 1%
- (in symbol R0805_510R_1%_0.125W_100PPM) 1%

### Library data of the parts
C2 C4 C8 C10-C16 C30 = CC0805_100NF_50V_10%_X7R: as C18 on sheet Bank; Part Number: CC0805_100NF_50V_10%_X7R; Component Kind: Standard; Component Type: Standard; Pin Count: 2; Value: 100nF; Status: Preferred; Manufacturer Part Number: CC0805_100NF_50V_10%_X7R; Case: 0805; Mounted: Yes; Socket: No; SMD: Yes; Sense: No; Manufacturer1 Example: TDK; Manufacturer1 ComponentHeight: 1mm; HelpURL: \\cern.ch\dfs\Applications\Altium\Datasheets\CC0805_X7R_TDK_C.pdf; Author: CERN DEM JLC; CreateDate: 03.12.2007; LatestRevisionDate: 22.04.2015
C5 = CC0805_100PF_50V_5%_C0G_KEMET_C0805C101J5GACAUTO: Non-polarised capacitor; Part Description: SMD Multilayer Chip Ceramic Capacitor (Automotive Grade); Manufacturer: KEMET; Voltage: 50V; TC: C0G/NP0; Tolerance: ±5%; Part Number: CC0805_100PF_50V_5%_C0G_KEMET_C0805C101J5GACAUTO; Component Kind: Standard; Component Type: Standard; Pin Count: 2; Value: 100pF; Status: Not Recommended; Manufacturer Part Number: C0805C101J5GACAUTO; Case: 0805; Mounted: Yes; Socket: No; SMD: Yes; Sense: No; ComponentHeight: 0.88mm; HelpURL: \\cern.ch\dfs\Applications\Altium\Datasheets\CC0805_KEMET_C0805C101J5GACAUTO.pdf; Author: CERN DEM BC; CreateDate: 26.02.2016; LatestRevisionDate: 26.02.2016
C6 = CC0805_10PF_50V_1%_NP0: Non-polarised capacitor; Part Description: SMD Multilayer Chip Ceramic Capacitor; Manufacturer: GENERIC; Manufacturer1 Part Number: 223886118109; Voltage: 50V; TC: C0G/NP0; Tolerance: ±1%; Part Number: CC0805_10PF_50V_1%_NP0; Component Kind: Standard; Component Type: Standard; Pin Count: 2; Value: 10pF; Status: None; Manufacturer Part Number: CC0805_10PF_50V_1%_NP0; Case: 0805; Mounted: Yes; Socket: No; SMD: Yes; Sense: No; Manufacturer1 Example: PHYCOMP; Manufacturer1 ComponentHeight: 1.35mm; HelpURL: \\cern.ch\dfs\Applications\Altium\Datasheets\CC0805_NP0_PHYCOMP.pdf; Author: CERN DEM MR; CreateDate: 31.05.2016; LatestRevisionDate: 31.05.2016
IC1 = MCP1702T-5002E/CB: 3-Terminal Regulator 1=GND 2=OUT 3=IN; Part Description: 5V 250mA Low Quiescent Current LDO Positive Voltage Regulator; Manufacturer: MICROCHIP TECHNOLOGY; PressFit: No; Bonding: No; Part Number: MCP1702T-5002E/CB; Component Kind: Standard; Component Type: Standard; Device: MCP1702T-5002E/CB; PackageDescription: SOT, 0.95mm Pitch; 3 Pin, 1.50mm W X 2.90mm L X 1.45mm H Body, IPC Medium Density; Manufacturer Part Number: MCP1702T-5002E/CB; Pin Count: 3; Case: SOT23-3; Mounted: Yes; Socket: No; SMD: Yes; Sense: No; ComponentHeight: 1.45mm; HelpURL: \\cern.ch\dfs\Applications\Altium\Datasheets\MCP1702T-5002E-CB.pdf; Author: CERN DEM JLC; CreateDate: 16.02.2017; LatestRevisionDate: 16.02.2017
IC2 = MAX1735EUK50+T: 200mA, Negative-Output, Low-Dropout Linear Regulator; Part Description: 5V, 200mA, Negative-Output, Low-Dropout Linear Regulator; Manufacturer: MAXIM; PressFit: No; Bonding: No; Part Number: MAX1735EUK50+T; Component Kind: Standard; Component Type: Standard; Device: MAX1735EUK50+T; PackageDescription: SOT, 0.95mm pitch; 5 pin, 1.60mm W X 2.90mm L X 1.45mm H body, IPC Medium Density; Manufacturer Part Number: MAX1735EUK50+T; Pin Count: 5; Case: SOT23-5; Mounted: Yes; Socket: No; SMD: Yes; Sense: No; ComponentHeight: 1.45mm; HelpURL: \\cern.ch\dfs\Applications\Altium\Datasheets\MAX1735EUK50+T.pdf; Author: CERN DEM JLC; CreateDate: 17.02.2010; LatestRevisionDate: 17.02.2010
IC3 = ADA4817-1: Name: ADA4817-1; Manufacturer: AD
IC4 = AD8055ANZ: Part Description: Low Cost, 300 MHz Voltage Feedback Amplifier; PressFit: No; Bonding: No; Part Number: AD8055ANZ; Component Kind: Standard; Component Type: Standard; Device: AD8055ANZ; Footprint: DIP8-300; PackageDescription: DIP 8 Leads, Row Spacing 7.62 mm; Pitch 2.54 mm; Manufacturer: ANALOG DEVICES; Manufacturer Part Number: AD8055ANZ; Pin Count: 7; Case: DIP8-300; Mounted: Yes; Socket: Yes; SMD: No; Sense: No; ComponentHeight: 5.33mm; Author: CERN DEM JLC; HelpURL: \\cern.ch\dfs\Applications\Altium\Datasheets\AD8055ANZ.pdf; CreateDate: 14.03.2011; LatestRevisionDate: 14.03.2011
IC5 = AD8131AR: Differential Amplifier; Part Description: Lost Cost, High Speed Differential Driver; Manufacturer: ANALOG DEVICES; PressFit: No; Bonding: No; Part Number: AD8131AR; Component Kind: Standard; Component Type: Standard; Device: AD8131AR; PackageDescription: SOIC 8, Pitch 1.27mm - Body 4x5mm, IPC Medium Density; Status: Not recommended; Manufacturer Part Number: AD8131AR; Pin Count: 7; Case: SOIC8; Mounted: Yes; Socket: No; SMD: Yes; Sense: No; ComponentHeight: 1.75mm; Author: CERN DEM JMW; HelpURL: \\cern.ch\dfs\Applications\Altium\Datasheets\AD8131AR.pdf; CreateDate: 23.09.2008; LatestRevisionDate: 13.04.2010
L1 L2 = IND1206_MURATA_BLM31PG500SN1: as L3 on sheet Main; Part Number: IND1206_MURATA_BLM31PG500SN1; Component Kind: Standard; Component Type: Standard; Pin Count: 2; Value: 50R@100MHz; Status: None; Manufacturer Part Number: BLM31PG500SN1; Case: 1206; Mounted: Yes; Socket: No; SMD: Yes; Sense: No; ComponentHeight: 1.3mm; HelpURL: \\cern.ch\dfs\Applications\Altium\Datasheets\IND1206_MURATA_BLM31P.pdf; Author: CERN DEM JLC; CreateDate: 05.12.2013; LatestRevisionDate: 05.12.2013
R1 R4 = R0805_5K1_1%_0.125W_100PPM: as R17 on sheet Main; Part Number: R0805_5K1_1%_0.125W_100PPM; Component Kind: Standard; Component Type: Standard; Pin Count: 2; Value: 5k1; Status: Preferred; Tolerance: ±1%; Manufacturer Part Number: R0805_5K1_1%_0.125W_100PPM; Case: 0805; Mounted: Yes; Sense: No; Socket: No; SMD: Yes; Manufacturer1 Example: NIC COMPONENT; Manufacturer1 ComponentHeight: 0.6mm; HelpURL: \\cern.ch\dfs\Applications\Altium\Datasheets\R0805_NIC_NRC.pdf; Author: CERN DEM JLC; CreateDate: 03.12.2007; LatestRevisionDate: 13.03.2008
R2 R3 R5 R7-R9 = R0805_3R_1%_0.125W_200PPM: Resistor - 1%; Part Description: General Purpose Thick Film Chip Resistor; Manufacturer: GENERIC; Manufacturer1 Part Number: 232273463008L or RC0805FR-073RL; Power: 0.125W; TC: ±200ppm/°C; PressFit: No; Part Number: R0805_3R_1%_0.125W_200PPM; Component Kind: Standard; Component Type: Standard; Pin Count: 2; Value: 3; Status: Preferred; Tolerance: ±1%; Manufacturer Part Number: R0805_3R_1%_0.125W_200PPM; Case: 0805; Mounted: Yes; Sense: No; Socket: No; SMD: Yes; Manufacturer1 Example: YAGEO PHYCOMP; Manufacturer1 ComponentHeight: 0.65mm; HelpURL: \\cern.ch\dfs\Applications\Altium\Datasheets\R0805_Phycomp_RC0805.pdf; Author: CERN DEM JLC; CreateDate: 03.12.2007; LatestRevisionDate: 17.10.2012
R6 = R0805_43K_1%_0.125W_100PPM: Resistor - 1%; Part Description: General Purpose Thick Film Chip Resistor; Manufacturer: GENERIC; Manufacturer1 Part Number: NRC10F4302TRF; Power: 0.125W; TC: ±100ppm/°C; PressFit: No; Part Number: R0805_43K_1%_0.125W_100PPM; Component Kind: Standard; Component Type: Standard; Pin Count: 2; Value: 43k; Status: Preferred; Tolerance: ±1%; Manufacturer Part Number: R0805_43K_1%_0.125W_100PPM; Case: 0805; Mounted: Yes; Sense: No; Socket: No; SMD: Yes; Manufacturer1 Example: NIC COMPONENT; Manufacturer1 ComponentHeight: 0.6mm; HelpURL: \\cern.ch\dfs\Applications\Altium\Datasheets\R0805_NIC_NRC.pdf; Author: CERN DEM JLC; CreateDate: 03.12.2007; LatestRevisionDate: 13.03.2008
R10 R11 = R0805_51R_1%_0.125W_100PPM: Resistor - 1%; Part Description: General Purpose Thick Film Chip Resistor; Manufacturer: GENERIC; Manufacturer1 Part Number: NRC10F51R0TRF; Power: 0.125W; TC: ±100ppm/°C; PressFit: No; Part Number: R0805_51R_1%_0.125W_100PPM; Component Kind: Standard; Component Type: Standard; Pin Count: 2; Value: 51; Status: Preferred; Tolerance: ±1%; Manufacturer Part Number: R0805_51R_1%_0.125W_100PPM; Case: 0805; Mounted: Yes; Sense: No; Socket: No; SMD: Yes; Manufacturer1 Example: NIC COMPONENT; Manufacturer1 ComponentHeight: 0.6mm; HelpURL: \\cern.ch\dfs\Applications\Altium\Datasheets\R0805_NIC_NRC.pdf; Author: CERN DEM JLC; CreateDate: 03.12.2007; LatestRevisionDate: 13.03.2008
R13 = R0805_510R_1%_0.125W_100PPM: as R16 on sheet Main; Part Number: R0805_510R_1%_0.125W_100PPM; Component Kind: Standard; Component Type: Standard; Pin Count: 2; Value: 510; Status: Preferred; Tolerance: ±1%; Manufacturer Part Number: R0805_510R_1%_0.125W_100PPM; Case: 0805; Mounted: Yes; Sense: No; Socket: No; SMD: Yes; Manufacturer1 Example: NIC COMPONENT; Manufacturer1 ComponentHeight: 0.6mm; HelpURL: \\cern.ch\dfs\Applications\Altium\Datasheets\R0805_NIC_NRC.pdf; Author: CERN DEM JLC; CreateDate: 03.12.2007; LatestRevisionDate: 13.03.2008
R19 = R0805_1K_1%_0.125W_100PPM: as R14 on sheet Main; Part Number: R0805_1K_1%_0.125W_100PPM; Component Kind: Standard; Component Type: Standard; Pin Count: 2; Value: 1k; Status: Preferred; Tolerance: ±1%; Manufacturer Part Number: R0805_1K_1%_0.125W_100PPM; Case: 0805; Mounted: Yes; Sense: No; Socket: No; SMD: Yes; Manufacturer1 Example: NIC COMPONENT; Manufacturer1 ComponentHeight: 0.6mm; HelpURL: \\cern.ch\dfs\Applications\Altium\Datasheets\R0805_NIC_NRC.pdf; Author: CERN DEM JLC; CreateDate: 03.12.2007; LatestRevisionDate: 13.03.2008
T1 = SST213: N-CHANNEL DMOS FET WITH ZENER DIODE; Part Description: Fast DMOS FET Switches N-Channel Enhancement-Mode; Manufacturer: CALOGIC; PressFit: No; Bonding: No; Part Number: SST213; Component Kind: Standard; Component Type: Standard; Device: SST213; PackageDescription: SOT143, 4-Leads, Body 3.0x2.6mm (max), Pitch 1.92mm, IPC Medium Density; Manufacturer Part Number: SST213; Pin Count: 4; Case: SOT143N; Mounted: Yes; Socket: No; SMD: Yes; Sense: No; ComponentHeight: 1.3mm; HelpURL: \\cern.ch\dfs\Applications\Altium\Datasheets\SST213.pdf; Author: CERN DEM MR; CreateDate: 19.05.2016; LatestRevisionDate: 19.05.2016